# Altium schematic sheet Analog_Sensors.SchDoc: Analog Sensors
size A4; CompanyName: HEIG-VD; Organization: Institut d'Automatisation Industrielle; SheetNumber: 4; SheetTotal: 6; SheetFormat: A4; CurrentTime: 6; CurrentDate: 5; DocumentFullPathAndName: 8; DocumentName: 9; ModifiedDate: 13; ProjectName: <projet>
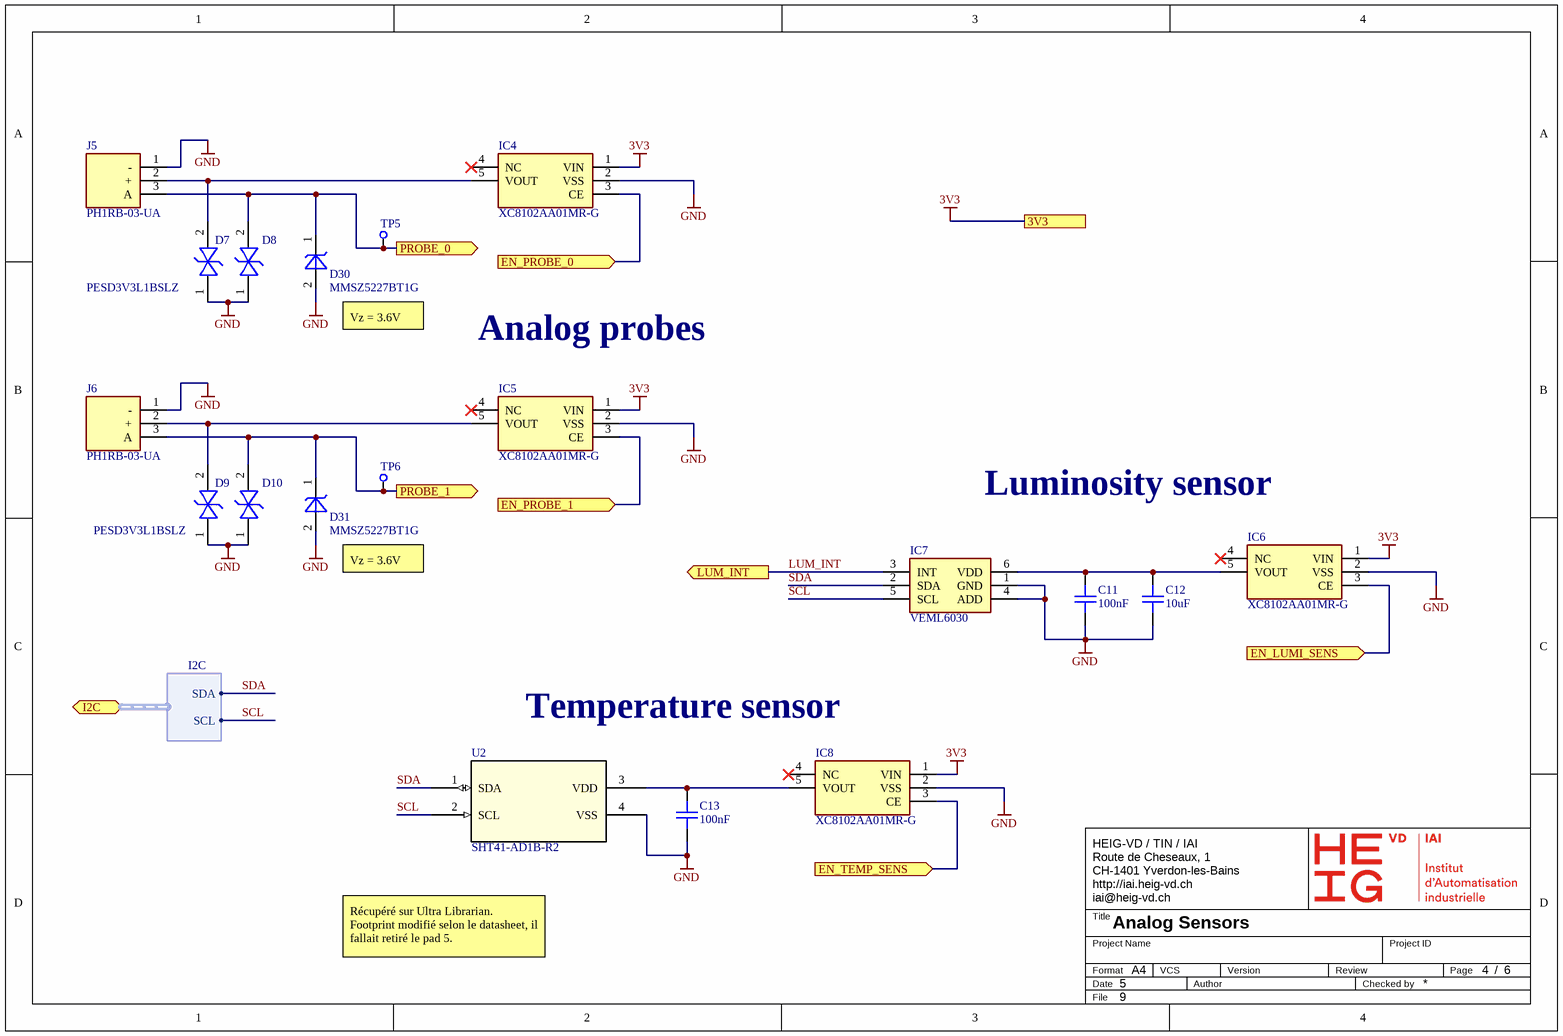
[diagram p0: Analog_Sensors.SchDoc]

## Parts
C11  100nF  [CAPC1005X05N]
C12  10uF  [CAPC3216X18N]
C13  100nF  [CAPC1005X05N]
D7  PESD3V3L1BSLZ  [PESD3V3L1BSLZ]  (value not drawn)
D8  PESD3V3L1BSLZ  [PESD3V3L1BSLZ]
D9  PESD3V3L1BSLZ  [PESD3V3L1BSLZ]  (value not drawn)
D10  PESD3V3L1BSLZ  [PESD3V3L1BSLZ]
D30  MMSZ5227BT1G  [SOD3717X135]
D31  MMSZ5227BT1G  [SOD3717X135]
IC4  XC8102AA01MR-G  [SOT95P280X130-5N]
IC5  XC8102AA01MR-G  [SOT95P280X130-5N]
IC6  XC8102AA01MR-G  [SOT95P280X130-5N]
IC7  VEML6030  [VEML6030]
IC8  XC8102AA01MR-G  [SOT95P280X130-5N]
J5  PH1RB-03-UA  [HDRRA3W64P0X254_1X3_762X250X301P]
J6  PH1RB-03-UA  [HDRRA3W64P0X254_1X3_762X250X301P]
TP5  ICT Test Point - TH Round Pad  [TPICTTH09N]  (value not drawn)  (no BOM)
TP6  ICT Test Point - TH Round Pad  [TPICTTH09N]  (value not drawn)  (no BOM)
U2  SHT41-AD1B-R2  [DFN4_SHT41_SEN]

## Ports
3V3, EN_LUMI_SENS (in), EN_PROBE_0 (in), EN_PROBE_1 (in), EN_TEMP_SENS (in), I2C (bidir, harness I2C), LUM_INT (out), PROBE_0 (out), PROBE_1 (out)

## Harnesses
I2C: SDA, SCL

## Nets
3V3: IC4.1(VIN) IC5.1(VIN) IC6.1(VIN) IC8.1(VIN) ; port 3V3
GND: C11.2 C12.1 C13.2 D7.1(K1) D8.1(K1) D9.1(K1) D10.1(K1) D30.2(A) D31.2(A) IC4.2(VSS) IC5.2(VSS) IC6.2(VSS) IC7.1(GND) IC7.4(ADD) IC8.2(VSS) J5.1(-) J6.1(-) U2.4(VSS)
EN_LUMI_SENS: IC6.3(CE) ; port EN_LUMI_SENS
EN_PROBE_0: IC4.3(CE) ; port EN_PROBE_0
EN_PROBE_1: IC5.3(CE) ; port EN_PROBE_1
EN_TEMP_SENS: IC8.3(CE) ; port EN_TEMP_SENS
LUM_INT: IC7.3(INT) ; port LUM_INT
PROBE_0: D8.2(K2) D30.1(K) J5.3(A) TP5.1 ; port PROBE_0
PROBE_1: D10.2(K2) D31.1(K) J6.3(A) TP6.1 ; port PROBE_1
SCL: IC7.5(SCL) U2.2(SCL) ; port I2C.SCL
SDA: IC7.2(SDA) U2.1(SDA) ; port I2C.SDA
NetC11_1: C11.1 C12.2 IC6.5(VOUT) IC7.6(VDD)
NetC13_1: C13.1 IC8.5(VOUT) U2.3(VDD)
NetD7_2: D7.2(K2) IC4.5(VOUT) J5.2(+)
NetD9_2: D9.2(K2) IC5.5(VOUT) J6.2(+)

Not connected (* = marked no-connect by the designer): IC4 4(NC)*; IC5 4(NC)*; IC6 4(NC)*; IC8 4(NC)*

## Notes on the sheet
- Vz = 3.6V
- Analog probes
- Luminosity sensor
- Temperature sensor
- Récupéré sur Ultra Librarian. Footprint modifié selon le datasheet, il fallait retiré le pad 5.
- Title
- HEIG-VD / TIN / IAI
  Route de Cheseaux, 1
  CH-1401 Yverdon-les-Bains
  http://iai.heig-vd.ch
  iai@heig-vd.ch
- Format
- Date
- Project Name
- VCS
- Author
- Version
- Review
- Checked by
- Project ID
- Page
- /
- File

## Library data of the parts
C11 C13 = CMP-0003371-1: 100nF 10% 50V Ceramic Capacitor X8L 0402 (1005 Metric); Value: 100nF; Max Operating Temperature: 150°C; Case/Package: 0402 (1005 Metric); Temperature Coefficient: X8L; Mounting Technology: Surface Mount; Voltage Rating: 50V; Min Operating Temperature: -55°C; RoHS Compliant: Yes; Tolerance: 10%
C12 = CMP-0001778-4: 10 µF ±10% 50V Ceramic Capacitor X7R 1206 (3216 Metric); Value: 10µF; Max Operating Temperature: 125°C; Mounting Technology: Surface Mount; RoHS Compliant: Yes; Min Operating Temperature: -55°C; Temperature Coefficient: X7R; Tolerance: 10%; Voltage Rating: 50V; Case/Package: 1206 (3216 Metric)
D7-D10 = PESD3V3L1BSLZ: Diode ESD (Bi-directional); Manufacturer_Name: Nexperia; Datasheet Link: https://assets.nexperia.com/documents/data-sheet/PESD3V3L1BSL.pdf; Height: 0.45mm; Manufacturer_Part_Number: PESD3V3L1BSLZ; Mouser Part Number: 771-PESD3V3L1BSLZ; Mouser Price/Stock: https://www.mouser.co.uk/ProductDetail/Nexperia/PESD3V3L1BSLZ?qs=Li%252BoUPsLEnsrB%2FnSgNrAWw%3D%3D
D30 D31 = CMP-0005471-4: Zener Diode 3.6V 500 mW ±5% Surface Mount SOD-123; Forward Voltage: 900mV; Power: 500mW; Impedance: 24; Mounting Technology: Surface Mount; RoHS Compliant: Yes; Tolerance: 5%; Max Operating Temperature: 155°C; Case/Package: SOD-123; Min Operating Temperature: -55°C; Zener Voltage: 3.6V
IC4-IC6 IC8 = XC8102AA01MR-G: Integrated Circuit; Manufacturer_Name: Torex; Datasheet Link: https://www.torexsemi.com/file/xc8102/XC8102.pdf; Height: 1.3mm; Manufacturer_Part_Number: XC8102AA01MR-G; Mouser Part Number: 865-XC8102AA01MR-G; Mouser Price/Stock: https://www.mouser.co.uk/ProductDetail/Torex-Semiconductor/XC8102AA01MR-G?qs=AsjdqWjXhJ%2FtsvzBWYmfYQ%3D%3D
IC7 = VEML6030: Integrated Circuit; Manufacturer_Name: Vishay; Datasheet Link: https://www.vishay.com/docs/84366/veml6030.pdf; Height: 0.87mm; Manufacturer_Part_Number: VEML6030; Mouser Part Number: 78-VEML6030; Mouser Price/Stock: https://www.mouser.co.uk/ProductDetail/Vishay-Semiconductors/VEML6030?qs=oeTp6q%252Bm7GMZCCnCKRrv4g%3D%3D; Arrow Part Number: VEML6030; Arrow Price/Stock: https://www.arrow.com/en/products/veml6030/vishay?utm_currency=USD&region=nac
J5 J6 = PH1RB-03-UA: Connector; Manufacturer_Name: Adam Tech; Datasheet Link: https://app.adam-tech.com/products/download/data_sheet/201281/ph1rb-xx-ua-data-sheet.pdf; Height: 3.008mm; Manufacturer_Part_Number: PH1RB-03-UA; Mouser Part Number: 737-PH1RB-03-UA; Mouser Price/Stock: https://www.mouser.co.uk/ProductDetail/Adam-Tech/PH1RB-03-UA?qs=HoCaDK9Nz5dMpkzb4k6qpA%3D%3D; Arrow Part Number: PH1RB-03-UA; Arrow Price/Stock: https://www.arrow.com/en/products/ph1rb-03-ua/adam-tech?utm_currency=USD&region=nac; System: Connector
TP5 TP6 = CMP-0005616-2: Through hole test point round pad for in-circuit test; Mounting Technology: Not Applicable; Max Operating Temperature: 125°C; RoHS Compliant: Yes; Colour: No Colour; Case/Package: No Case; Min Operating Temperature: -55°C; NetName: NetName
U2 = SHT41-AD1B-R2: No Description Available; Mfr_Name: Sensirion; RefDes: RefDes; Type: Type